# Altium schematic sheet norbi_lm_interfaces.SchDoc: Имя
size 410 x 297 mm; ApprovedBy: Утвердил; CheckedBy: Проверил; Author: Разработал; Organization: НГУ; DocumentNumber: Децимальный номер Э3; SheetNumber: Лист; SheetTotal: Листов; PageSetup: Record=PageOptions|CenterHorizontal=True|CenterVertical=True|PrintScale=1.00|XCorrection=1.00|YCorrection=1.00|PrintKind=1|BorderSize=5000000|LeftOffset=0|BottomOffset=0|Orientation=2|PaperLength=1000|PaperWidth=1000|Scale=100|PaperSource=15|PrintQuality=1200|MediaType=1|DitherType=10|PaperKind=A3|PrintScaleMode=1; Weight: -; ScaleFactor: -; NormInspection: Норм.Контр.
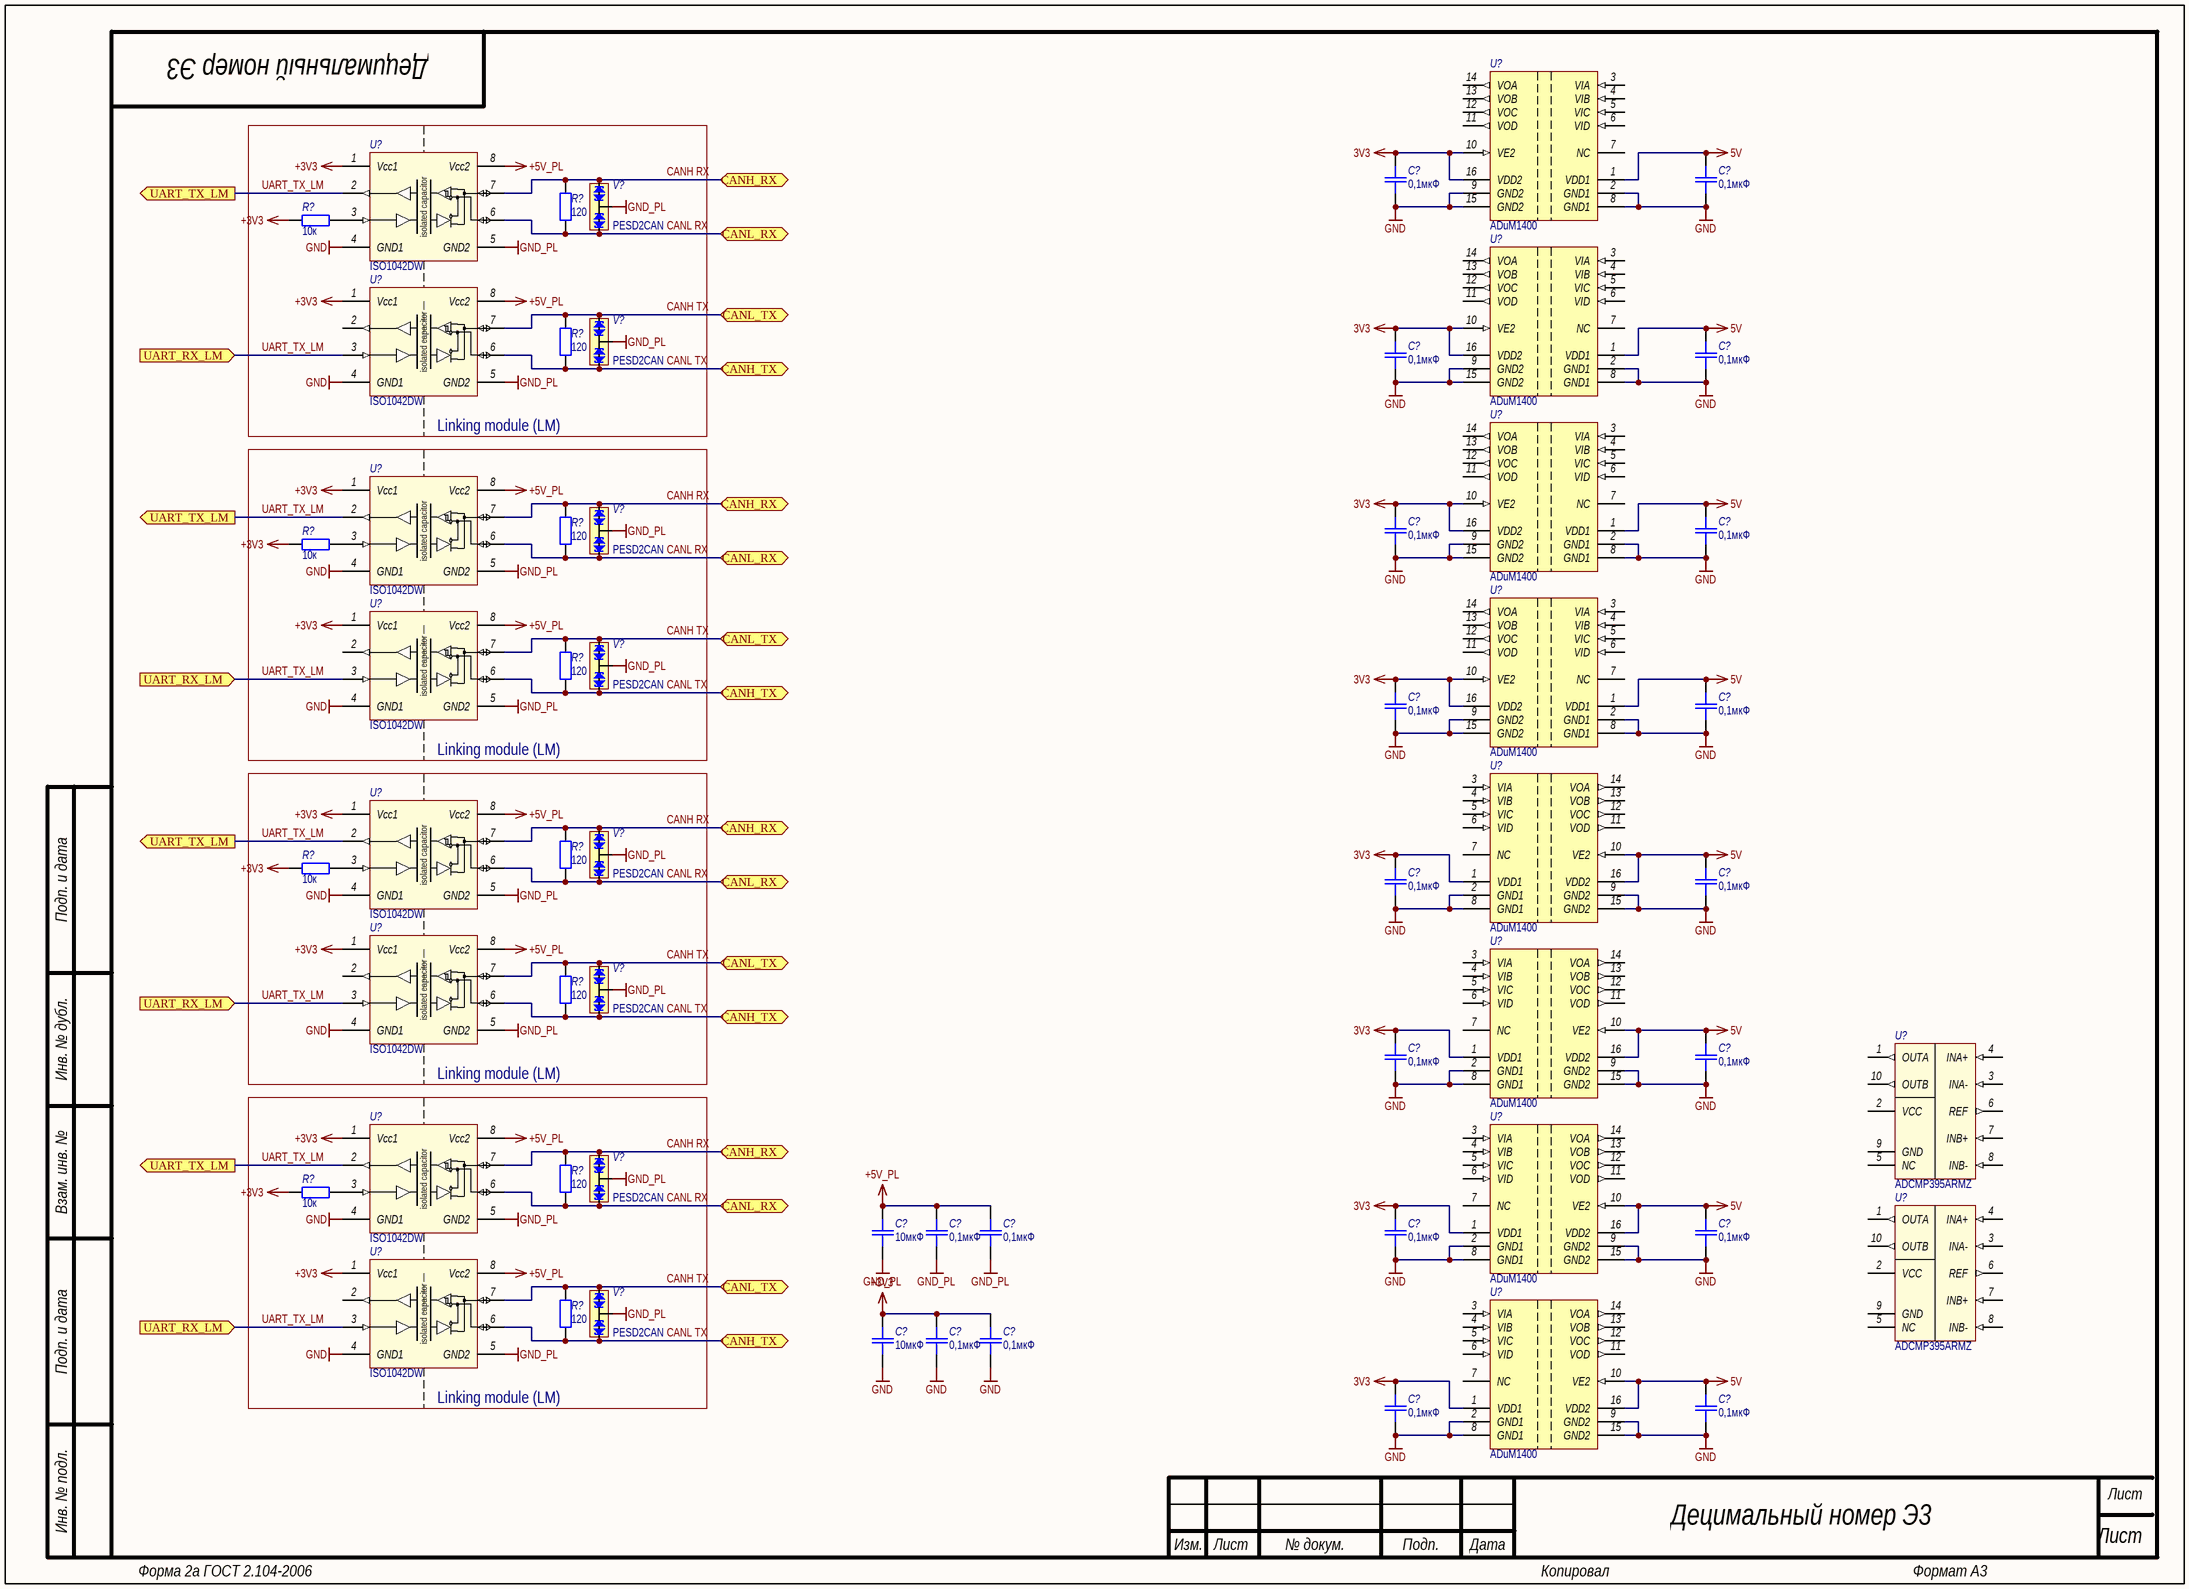
[diagram p0: norbi_lm_interfaces.SchDoc]

## Parts
(Parts that share a designator on the sheet are numbered #1, #2 ... from top to bottom, then left to right.)
C?#1  0,1мкФ  [CR-0402]
C?#2  0,1мкФ  [CR-0402]
C?#3  0,1мкФ  [CR-0402]
C?#4  0,1мкФ  [CR-0402]
C?#5  0,1мкФ  [CR-0402]
C?#6  0,1мкФ  [CR-0402]
C?#7  0,1мкФ  [CR-0402]
C?#8  0,1мкФ  [CR-0402]
C?#9  0,1мкФ  [CR-0402]
C?#10  0,1мкФ  [CR-0402]
C?#11  0,1мкФ  [CR-0402]
C?#12  0,1мкФ  [CR-0402]
C?#13  10мкФ  [CR-0805]
C?#14  0,1мкФ  [CR-0805]
C?#15  0,1мкФ  [CR-0805]
C?#16  0,1мкФ  [CR-0402]
C?#17  0,1мкФ  [CR-0402]
C?#18  10мкФ  [CR-0805]
C?#19  0,1мкФ  [CR-0805]
C?#20  0,1мкФ  [CR-0805]
C?#21  0,1мкФ  [CR-0402]
C?#22  0,1мкФ  [CR-0402]
R?#1  120  [CR-0402]
R?#2  10к  [CR-0402]
R?#3  120  [CR-0402]
R?#4  120  [CR-0402]
R?#5  10к  [CR-0402]
R?#6  120  [CR-0402]
R?#7  120  [CR-0402]
R?#8  10к  [CR-0402]
R?#9  120  [CR-0402]
R?#10  120  [CR-0402]
R?#11  10к  [CR-0402]
R?#12  120  [CR-0402]
U?#1  ADuM1400  [SOIC-16-WIDE]
U?#2  Наименование: ISO1042DW  [SOIC-8-WIDE]  (hidden comment: ISO1042)
U?#3  ADuM1400  [SOIC-16-WIDE]
U?#4  Наименование: ISO1042DW  [SOIC-8-WIDE]  (hidden comment: ISO1042)
U?#5  ADuM1400  [SOIC-16-WIDE]
U?#6  Наименование: ISO1042DW  [SOIC-8-WIDE]  (hidden comment: ISO1042)
U?#7  Наименование: ISO1042DW  [SOIC-8-WIDE]  (hidden comment: ISO1042)
U?#8  ADuM1400  [SOIC-16-WIDE]
U?#9  Наименование: ISO1042DW  [SOIC-8-WIDE]  (hidden comment: ISO1042)
U?#10  ADuM1400  [SOIC-16-WIDE]
U?#11  Наименование: ISO1042DW  [SOIC-8-WIDE]  (hidden comment: ISO1042)
U?#12  ADuM1400  [SOIC-16-WIDE]
U?#13  ADCMP395ARMZ  [MSOP-10]
U?#14  Наименование: ISO1042DW  [SOIC-8-WIDE]  (hidden comment: ISO1042)
U?#15  ADuM1400  [SOIC-16-WIDE]
U?#16  ADCMP395ARMZ  [MSOP-10]
U?#17  Наименование: ISO1042DW  [SOIC-8-WIDE]  (hidden comment: ISO1042)
U?#18  ADuM1400  [SOIC-16-WIDE]
V?#1  PESD2CAN  [SOT-23]
V?#2  PESD2CAN  [SOT-23]
V?#3  PESD2CAN  [SOT-23]
V?#4  PESD2CAN  [SOT-23]
V?#5  PESD2CAN  [SOT-23]
V?#6  PESD2CAN  [SOT-23]
V?#7  PESD2CAN  [SOT-23]
V?#8  PESD2CAN  [SOT-23]

## Blocks framed on the sheet
Linking module (LM): R?#1-R?#3 U?#2 U?#4 V?#1 V?#2
Linking module (LM): R?#4-R?#6 U?#6 U?#7 V?#3 V?#4
Linking module (LM): R?#7-R?#9 U?#9 U?#11 V?#5 V?#6
Linking module (LM): R?#10-R?#12 U?#14 U?#17 V?#7 V?#8

## Ports
CANH_RX (bidir), CANH_TX (bidir), CANL_RX (bidir), CANL_TX (bidir), UART_RX_LM (in), UART_TX_LM (out)

## Nets
3V3: C?#1.2 C?#3.2 C?#5.2 C?#7.2 C?#9.2 C?#11.2 C?#16.2 C?#21.2 U?#1.10(VE2) U?#1.16(VDD2) U?#3.10(VE2) U?#3.16(VDD2) U?#5.10(VE2) U?#5.16(VDD2) U?#8.10(VE2) U?#8.16(VDD2) U?#10.1(VDD1) U?#12.1(VDD1) U?#15.1(VDD1) U?#18.1(VDD1)
5V: C?#2.2 C?#4.2 C?#6.2 C?#8.2 C?#10.2 C?#12.2 C?#17.2 C?#22.2 U?#1.1(VDD1) U?#3.1(VDD1) U?#5.1(VDD1) U?#8.1(VDD1) U?#10.10(VE2) U?#10.16(VDD2) U?#12.10(VE2) U?#12.16(VDD2) U?#15.10(VE2) U?#15.16(VDD2) U?#18.10(VE2) U?#18.16(VDD2)
+3V3: C?#18.2 C?#19.2 C?#20.2 R?#2.1 R?#5.1 R?#8.1 R?#11.1 U?#2.1(Vcc1) U?#4.1(Vcc1) U?#6.1(Vcc1) U?#7.1(Vcc1) U?#9.1(Vcc1) U?#11.1(Vcc1) U?#14.1(Vcc1) U?#17.1(Vcc1)
+5V_PL: C?#13.2 C?#14.2 C?#15.2 U?#2.8(Vcc2) U?#4.8(Vcc2) U?#6.8(Vcc2) U?#7.8(Vcc2) U?#9.8(Vcc2) U?#11.8(Vcc2) U?#14.8(Vcc2) U?#17.8(Vcc2)
GND: C?#1.1 C?#2.1 C?#3.1 C?#4.1 C?#5.1 C?#6.1 C?#7.1 C?#8.1 C?#9.1 C?#10.1 C?#11.1 C?#12.1 C?#16.1 C?#17.1 C?#18.1 C?#19.1 C?#20.1 C?#21.1 C?#22.1 U?#1.2(GND1) U?#1.8(GND1) U?#1.9(GND2) U?#1.15(GND2) U?#2.4(GND1) U?#3.2(GND1) U?#3.8(GND1) U?#3.9(GND2) U?#3.15(GND2) U?#4.4(GND1) U?#5.2(GND1) U?#5.8(GND1) U?#5.9(GND2) U?#5.15(GND2) U?#6.4(GND1) U?#7.4(GND1) U?#8.2(GND1) U?#8.8(GND1) U?#8.9(GND2) U?#8.15(GND2) U?#9.4(GND1) U?#10.2(GND1) U?#10.8(GND1) U?#10.9(GND2) U?#10.15(GND2) U?#11.4(GND1) U?#12.2(GND1) U?#12.8(GND1) U?#12.9(GND2) U?#12.15(GND2) U?#14.4(GND1) U?#15.2(GND1) U?#15.8(GND1) U?#15.9(GND2) U?#15.15(GND2) U?#17.4(GND1) U?#18.2(GND1) U?#18.8(GND1) U?#18.9(GND2) U?#18.15(GND2)
GND_PL: C?#13.1 C?#14.1 C?#15.1 U?#2.5(GND2) U?#4.5(GND2) U?#6.5(GND2) U?#7.5(GND2) U?#9.5(GND2) U?#11.5(GND2) U?#14.5(GND2) U?#17.5(GND2) V?#1.3(CC) V?#2.3(CC) V?#3.3(CC) V?#4.3(CC) V?#5.3(CC) V?#6.3(CC) V?#7.3(CC) V?#8.3(CC)
CANH RX: R?#1.2 R?#4.2 R?#7.2 R?#10.2 U?#2.7(CANH) U?#6.7(CANH) U?#9.7(CANH) U?#14.7(CANH) V?#1.2(C2) V?#3.2(C2) V?#5.2(C2) V?#7.2(C2) ; port CANH_RX
CANH TX: R?#3.2 R?#6.2 R?#9.2 R?#12.2 U?#4.7(CANH) U?#7.7(CANH) U?#11.7(CANH) U?#17.7(CANH) V?#2.2(C2) V?#4.2(C2) V?#6.2(C2) V?#8.2(C2) ; port CANL_TX
CANL RX: R?#1.1 R?#4.1 R?#7.1 R?#10.1 U?#2.6(CANL) U?#6.6(CANL) U?#9.6(CANL) U?#14.6(CANL) V?#1.1(C1) V?#3.1(C1) V?#5.1(C1) V?#7.1(C1) ; port CANL_RX
CANL TX: R?#3.1 R?#6.1 R?#9.1 R?#12.1 U?#4.6(CANL) U?#7.6(CANL) U?#11.6(CANL) U?#17.6(CANL) V?#2.1(C1) V?#4.1(C1) V?#6.1(C1) V?#8.1(C1) ; port CANH_TX
UART_TX_LM: U?#2.2(RXD) U?#4.3(TXD) U?#6.2(RXD) U?#7.3(TXD) U?#9.2(RXD) U?#11.3(TXD) U?#14.2(RXD) U?#17.3(TXD) ; port UART_TX_LM, port UART_RX_LM
NetR?#2_2: R?#2.2 U?#2.3(TXD)
NetR?#5_2: R?#5.2 U?#6.3(TXD)
NetR?#8_2: R?#8.2 U?#9.3(TXD)
NetR?#11_2: R?#11.2 U?#14.3(TXD)

Not connected (* = marked no-connect by the designer): U?#1 3(VIA) 4(VIB) 5(VIC) 6(VID) 7(NC) 11(VOD) 12(VOC) 13(VOB) 14(VOA); U?#3 3(VIA) 4(VIB) 5(VIC) 6(VID) 7(NC) 11(VOD) 12(VOC) 13(VOB) 14(VOA); U?#4 2(RXD); U?#5 3(VIA) 4(VIB) 5(VIC) 6(VID) 7(NC) 11(VOD) 12(VOC) 13(VOB) 14(VOA); U?#7 2(RXD); U?#8 3(VIA) 4(VIB) 5(VIC) 6(VID) 7(NC) 11(VOD) 12(VOC) 13(VOB) 14(VOA); U?#10 3(VIA) 4(VIB) 5(VIC) 6(VID) 7(NC) 11(VOD) 12(VOC) 13(VOB) 14(VOA); U?#11 2(RXD); U?#12 3(VIA) 4(VIB) 5(VIC) 6(VID) 7(NC) 11(VOD) 12(VOC) 13(VOB) 14(VOA); U?#13 1(OUTA) 2(VCC) 3(INA-) 4(INA+) 5(NC) 6(REF) 7(INB+) 8(INB-) 9(GND) 10(OUTB); U?#15 3(VIA) 4(VIB) 5(VIC) 6(VID) 7(NC) 11(VOD) 12(VOC) 13(VOB) 14(VOA); U?#16 1(OUTA) 2(VCC) 3(INA-) 4(INA+) 5(NC) 6(REF) 7(INB+) 8(INB-) 9(GND) 10(OUTB); U?#17 2(RXD); U?#18 3(VIA) 4(VIB) 5(VIC) 6(VID) 7(NC) 11(VOD) 12(VOC) 13(VOB) 14(VOA)

## Notes on the sheet
- Подп. и дата
- Инв. № дубл.
- Взам. инв. №
- Инв. № подл.
- Изм.
- Лист
- № докум.
- Подп.
- Дата
- Форма 2а ГОСТ 2.104-2006
- Копировал
- Формат А3
- (in symbol ISO1042) isolated capacitor

## Library data of the parts
C?#1-C?#22 = C_smd: Конденсатор для поверхностного монтажа; Назначение: Чип-конденсатор; Наименование: К10-79 МП0 «ВП»; Потребление, Вт: 0
  C?#1-C?#12 C?#14-C?#17 C?#19-C?#22: Value: 0,1мкФ
  C?#13 C?#18: Value: 10мкФ
R?#1-R?#12 = R_smd: Резистор для поверхностного монтажа; Наименование: Р1-12-0.125 ОСМ; Назначение: Чип-резистор; Потребление, Вт: 0,001
  R?#1 R?#3 R?#4 R?#6 R?#7 R?#9 R?#10 R?#12: Value: 120
  R?#2 R?#5 R?#8 R?#11: Value: 10к
U?#1 U?#3 U?#5 U?#8 U?#10 U?#12 U?#15 U?#18 = ADuM1400: Quad Channel Digital Isolator, 2.5 KV rms Insulation Rating; Назначение: 4-канальный цифровой изолятор; Потребление, Вт: 0,025; Наименование: ADuM1400
U?#2 U?#4 U?#6 U?#7 U?#9 U?#11 U?#14 U?#17 = ISO1042: Isolated CAN Transceiver; Назначение: Изолированный CAN приемник; Потребление, Вт: 0,001
U?#13 U?#16 = ADCMP395: Dual Comparators with Accurate Reference Output; Потребление, Вт: 0,001; Назначение: Dual Comparators with Accurate Reference Output; Наименование: ADCMP395ARMZ; ComponentLink1Description: Datasheet; ComponentLink1URL: https://www.analog.com/en/products/adcmp395.html
V?#1-V?#8 = PESD2CAN: CAN bus ESD protection diode; Назначение: Защитная диодная сборка CAN-шины от ЭСР; Потребление, Вт: 0,001; Наименование: PESD2CAN